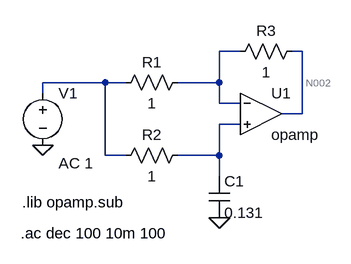
[diagram p0: schematic Ej1-Activo.asc]
Ej1-Activo.asc, the LTspice schematic file:
Version 4
SHEET 1 880 680
WIRE 224 128 192 128
WIRE 320 128 304 128
WIRE 16 176 -80 176
WIRE 48 176 16 176
WIRE 192 176 192 128
WIRE 192 176 128 176
WIRE -80 192 -80 176
WIRE 192 208 192 176
WIRE 224 208 192 208
WIRE 320 224 320 128
WIRE 320 224 288 224
WIRE 224 240 192 240
WIRE 16 288 16 176
WIRE 48 288 16 288
WIRE 192 288 192 240
WIRE 192 288 128 288
WIRE 192 320 192 288
FLAG -80 272 0
FLAG 192 384 0
SYMBOL res 144 160 R90
WINDOW 0 0 56 VBottom 2
WINDOW 3 32 56 VTop 2
SYMATTR InstName R1
SYMATTR Value 1
SYMBOL res 144 272 R90
WINDOW 0 0 56 VBottom 2
WINDOW 3 32 56 VTop 2
SYMATTR InstName R2
SYMATTR Value 1
SYMBOL cap 176 320 R0
SYMATTR InstName C1
SYMATTR Value 0.131
SYMBOL voltage -80 176 R0
WINDOW 123 24 124 Left 2
WINDOW 39 0 0 Left 0
SYMATTR InstName V1
SYMATTR Value ""
SYMATTR Value2 AC 1
SYMBOL OpAmps\\opamp 256 160 R0
SYMATTR InstName U1
SYMBOL res 320 112 R90
WINDOW 0 0 56 VBottom 2
WINDOW 3 32 56 VTop 2
SYMATTR InstName R3
SYMATTR Value 1
TEXT -112 360 Left 2 !.lib opamp.sub
TEXT -114 408 Left 2 !.ac dec 100 10m 100

The netlist it stands for:
* Ej1-Activo.asc
R1 N001 N003 1
R2 N004 N003 1
C1 N004 0 0.131
V1 N003 0 AC 1
XU1 N001 N004 N002 opamp Aol=100K GBW=10Meg  ; pins invin noninvin out
R3 N002 N001 1
.lib opamp.sub
.ac dec 100 10m 100
.backanno
.end

* Results of the author's LTspice run, read from the files saved beside the schematic
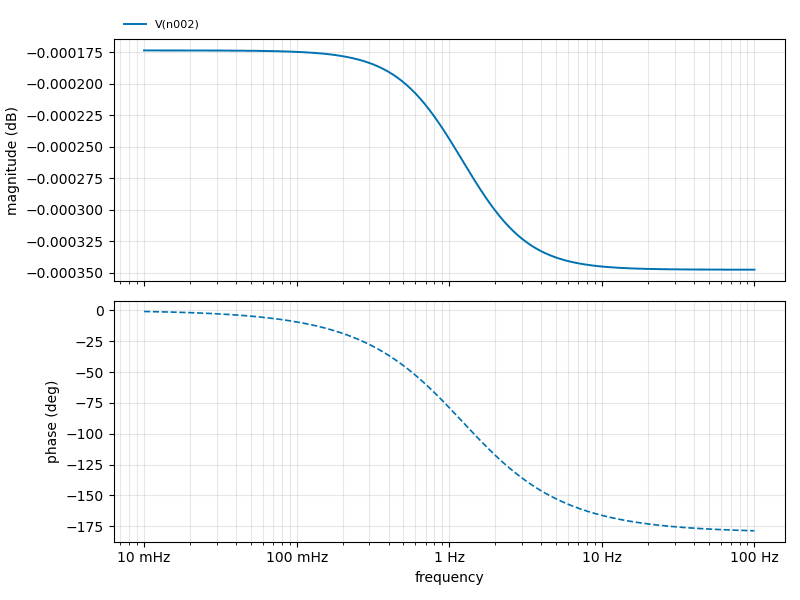
[diagram p1: AC Analysis of Ej1-Activo.asc, plotted from the saved traces]
* AC Analysis, 1 run:
*   V(n002): -0.00 dB at 10 mHz, -0.00 dB at 100 Hz, peak -0.00 dB at 10 mHz